# EAGLE schematic EAGLE-Piclodio3 (EAGLE 9.7.0)
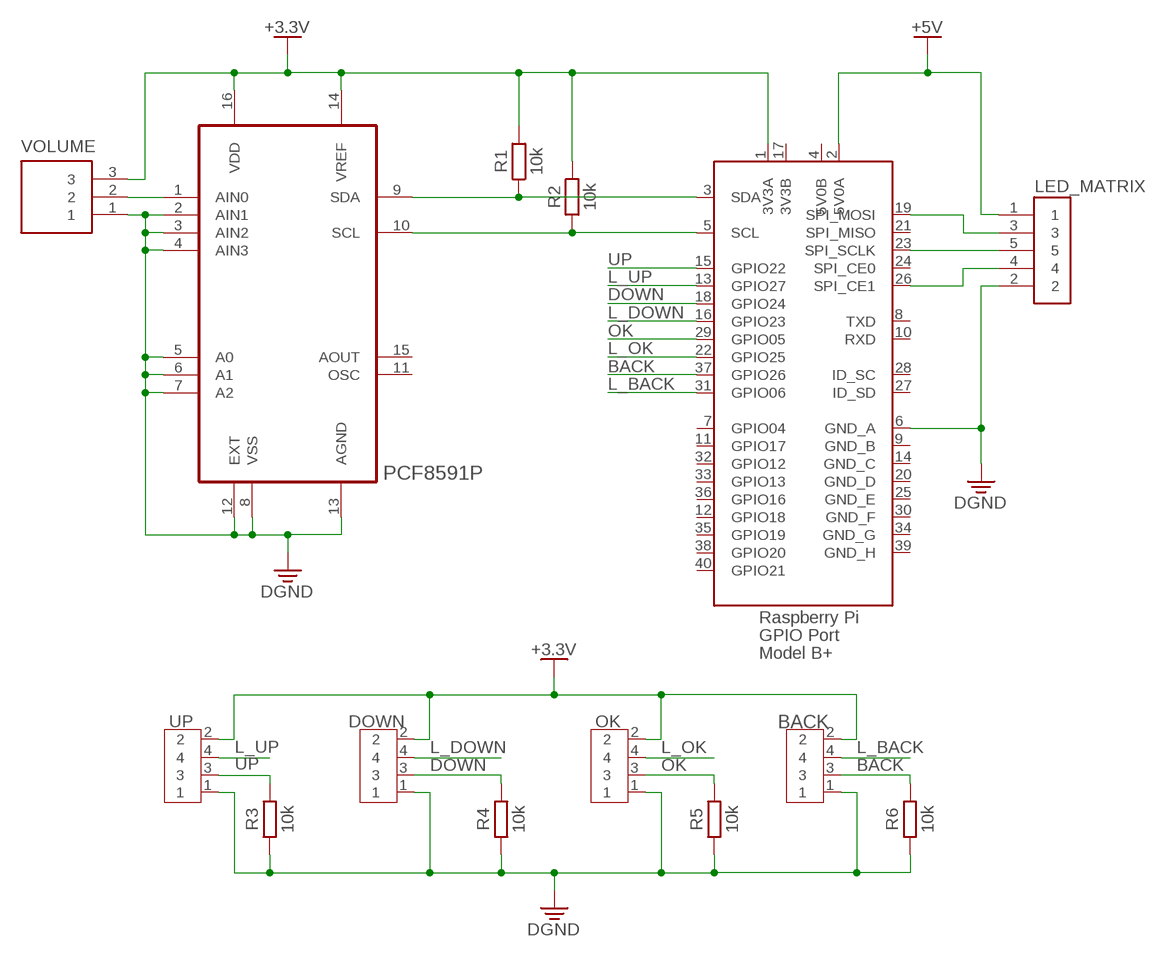
[diagram p0: schematic, sheet 1]

## Parts
BACK  3A/250V  B4B-XH-A  [B4B-XH-A]
DOWN  3A/250V  B4B-XH-A  [B4B-XH-A]
LED_MATRIX  S5B-XH-A(LF)(SN)  [JST_S5B-XH-A(LF)(SN)]
OK  3A/250V  B4B-XH-A  [B4B-XH-A]
R1  10k  R_AXIAL-11.7MM-PITCH  [RESAD1176W63L850D250B]
R2  10k  R_AXIAL-11.7MM-PITCH  [RESAD1176W63L850D250B]
R3  10k  R_AXIAL-11.7MM-PITCH  [RESAD1176W63L850D250B]
R4  10k  R_AXIAL-11.7MM-PITCH  [RESAD1176W63L850D250B]
R5  10k  R_AXIAL-11.7MM-PITCH  [RESAD1176W63L850D250B]
R6  10k  R_AXIAL-11.7MM-PITCH  [RESAD1176W63L850D250B]
U2  PCF8591P  [DIP254P762X420-16]
UP  3A/250V  B4B-XH-A  [B4B-XH-A]
VOLUME  S3B-XH-A(LF)(SN)  [JST_S3B-XH-A(LF)(SN)]
X1  RASPI_BOARD_B+#_H  [RASPI_BOARD_B+HAT]

## Nets
+3.3V: BACK.2 DOWN.2 OK.2 R1.2 R2.1 U2.14(VREF) U2.16(VDD) UP.2 VOLUME.3 X1.1(3V3A)
+5V: LED_MATRIX.1 X1.2(5V0A)
BACK: BACK.3 R6.2 X1.37(GPIO26)
DGND: BACK.1 DOWN.1 LED_MATRIX.2 OK.1 R3.1 R4.1 R5.1 R6.1 U2.2(AIN1) U2.3(AIN2) U2.4(AIN3) U2.5(A0) U2.6(A1) U2.7(A2) U2.8(VSS) U2.12(EXT) U2.13(AGND) UP.1 VOLUME.1 X1.6(GND_A)
DOWN: DOWN.3 R4.2 X1.18(GPIO24)
L_BACK: BACK.4 X1.31(GPIO06)
L_DOWN: DOWN.4 X1.16(GPIO23)
L_OK: OK.4 X1.22(GPIO25)
L_UP: UP.4 X1.13(GPIO27)
N$1: U2.1(AIN0) VOLUME.2
N$2: R2.2 U2.10(SCL) X1.5(SCL)
N$3: R1.1 U2.9(SDA) X1.3(SDA)
N$4: LED_MATRIX.5 X1.23(SPI_SCLK)
N$5: LED_MATRIX.3 X1.19(SPI_MOSI)
N$7: LED_MATRIX.4 X1.26(SPI_CE1)
OK: OK.3 R5.2 X1.29(GPIO05)
UP: R3.2 UP.3 X1.15(GPIO22)
Unconnected: U2.11(OSC) U2.15(AOUT) X1.4(5V0B) X1.7(GPIO04) X1.8(TXD) X1.9(GND_B) X1.10(RXD) X1.11(GPIO17) X1.12(GPIO18) X1.14(GND_C) X1.17(3V3B) X1.20(GND_D) X1.21(SPI_MISO) X1.24(SPI_CE0) X1.25(GND_E) X1.27(ID_SD) X1.28(ID_SC) X1.30(GND_F) X1.32(GPIO12) X1.33(GPIO13) X1.34(GND_G) X1.35(GPIO19) X1.36(GPIO16) X1.38(GPIO20) X1.39(GND_H) X1.40(GPIO21)

## Library data of the parts
BACK DOWN OK = B4B-XH-A (Version 2):B4B-XH-A: XH Connector Top Entry - 4POS Details see: Datasheet <http://www.jst-mfg.com/product/pdf/eng/eXH.pdf>; CATEGORY: CONNECTOR; DSECRIPTION: 2.5mm pitch/disconnctable crimp style connector; MANUFACTURER: JST (XH connector); MPN: B4B-XH-A; OPERATING_TEMPERATURE: -25 C to 85 C; PART_STATUS: ACTIVE; ROHS_COMPLIANT: COMPLAINT; SERIES: B4B-XH-A; SUB_CATEGORY: Through hole; TYPE: TOP ENTRY
LED_MATRIX = S5B-XH-A_LF__SN_ (version 2):S5B-XH-A(LF)(SN): XH Connector 2.5mm pitch/Disconnectable Crimp Style Connector; MANUFACTURER: JST; MAXIMUM_PACKAGE_HEIGHT: 6.1mm; PARTREV: N/A; STANDARD: Manufacturer_Recommendation
R1-R6 = Resistor:R: Resistor Fixed - Generic; CATEGORY: Resistor; SUB-CATEGORY: Fixed
U2 = PCF8591P:PCF8591P: 8-bit A/D and D/A converter; AVAILABILITY: Unavailable; DESCRIPTION: ADC, DAC 8 b 11.1k I²C, Serial 16-DIP; MF: NXP USA; MP: PCF8591P; PACKAGE: DIP-16 NXP Semiconductors; PRICE: None
UP = B4B-XH-A (Version 2):B4B-XH-A: XH Connector Top Entry - 4POS Details see: Datasheet <http://www.jst-mfg.com/product/pdf/eng/eXH.pdf>; CATEGORY: CONNECTOR; DSECRIPTION: 2.5mm pitch/disconnctable crimp style connector; MANUFACTURER: JST (XH connector); MPN: B4B-XH-A; OPERATING_TEMPERATURE: -25 C to 85 C; PART_STATUS: ACTIVE; ROHS_COMPLIANT: COMPLAINT; SERIES: B4B-XH-A; SPICEPREFIX: E; SUB_CATEGORY: Through hole; TYPE: TOP ENTRY
VOLUME = S3B-XH-A_LF__SN_:S3B-XH-A(LF)(SN): Connector Header Through Hole, Right Angle 3 position 0.098" (2.50mm); MANUFACTURER: JST; MAXIMUM_PACKAGE_HEIGHT: 6.1 mm; PARTREV: N/A; STANDARD: Manufacturer Recommendations
X1 = raspberrypi_bastelstube_v13 (version 2):RASPI_BOARD_B+#: Raspberry Pi GPIO connector with markings for the outer dimensions of the Raspberry Pi board model B+ with different sets of drill holes or mounting pads All pins connected